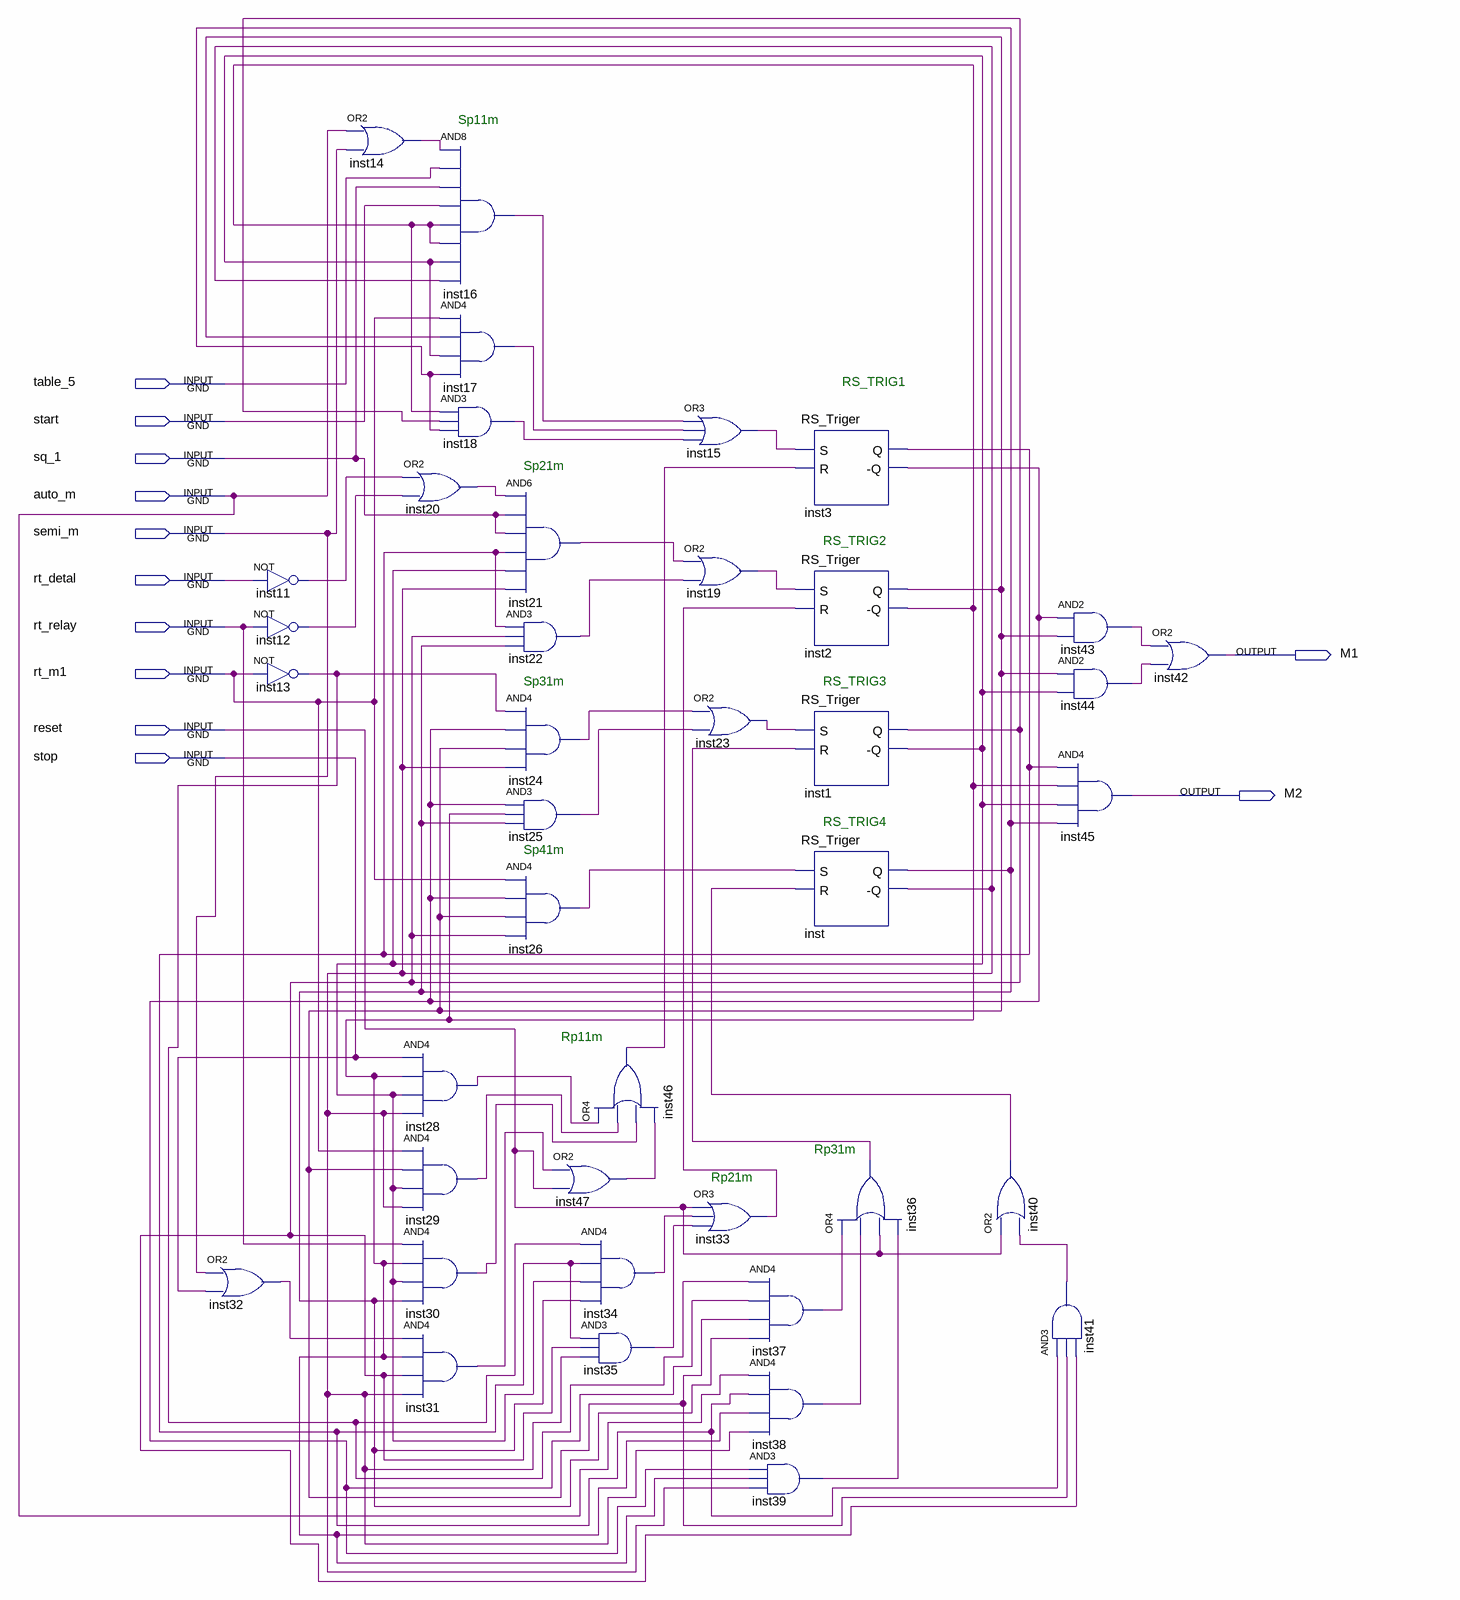
[diagram p0: schematic sheet]
// Quartus schematic auto_table_5.bdf as structural Verilog: 40 symbols, 12 pins
module auto_table_5 (
  input  table_5,
  input  start,
  input  sq_1,
  input  auto_m,
  input  semi_m,
  input  rt_detal,
  input  rt_relay,
  input  rt_m1,
  input  reset,
  input  stop,
  output M1,
  output M2
);

  wire inst1__q, inst1_q, inst2__q, inst2_q, inst3__q, inst3_q, inst11_out, inst12_out, inst13_out,
       inst14_out, inst15_out, inst16_out, inst17_out, inst18_out, inst19_out, inst20_out, inst21_out,
       inst22_out, inst23_out, inst24_out, inst25_out, inst26_out, inst28_out, inst29_out, inst30_out,
       inst31_out, inst32_out, inst33_out, inst34_out, inst35_out, inst36_out, inst37_out, inst38_out,
       inst39_out, inst40_out, inst41_out, inst43_out, inst44_out, inst46_out, inst47_out, inst__q, inst_q;

  or inst32 (inst32_out, semi_m, stop);
  not inst11 (inst11_out, rt_detal);
  not inst12 (inst12_out, rt_relay);
  not inst13 (inst13_out, rt_m1);
  or inst14 (inst14_out, auto_m, semi_m);
  and inst16 (inst16_out, inst14_out, table_5, sq_1, start, inst2__q, inst2__q, inst1__q, inst__q);
  and inst17 (inst17_out, rt_m1, inst2_q, inst1__q, inst_q);
  and inst18 (inst18_out, inst2__q, inst1_q, inst_q);
  or inst20 (inst20_out, inst11_out, inst12_out);
  and inst28 (inst28_out, stop, inst2__q, inst1__q, inst__q);
  and inst29 (inst29_out, rt_m1, inst2_q, inst1__q, inst__q);
  and inst30 (inst30_out, rt_relay, inst2__q, inst1__q, inst_q);
  and inst31 (inst31_out, inst32_out, inst2__q, inst1_q, inst__q);
  and inst21 (inst21_out, inst20_out, sq_1, sq_1, inst3_q, inst1__q, inst__q);
  and inst22 (inst22_out, inst3_q, inst1_q, inst_q);
  and inst24 (inst24_out, inst13_out, inst3__q, inst2_q, inst__q);
  and inst25 (inst25_out, inst3__q, inst2__q, inst_q);
  and inst26 (inst26_out, rt_m1, inst3__q, inst2_q, inst1_q);
  or inst46 (inst46_out, inst28_out, inst29_out, inst30_out, inst47_out);
  or inst47 (inst47_out, inst31_out, reset);
  and inst34 (inst34_out, inst13_out, inst3_q, inst1__q, inst_q);
  and inst35 (inst35_out, inst3_q, inst1_q, inst__q);
  or inst15 (inst15_out, inst16_out, inst17_out, inst18_out);
  or inst19 (inst19_out, inst21_out, inst22_out);
  or inst23 (inst23_out, inst24_out, inst25_out);
  or inst33 (inst33_out, reset, inst34_out, inst35_out);
  and inst37 (inst37_out, inst13_out, inst3__q, inst2_q, inst_q);
  and inst38 (inst38_out, auto_m, inst3_q, inst2__q, inst__q);
  and inst39 (inst39_out, inst3__q, inst2__q, inst__q);
  RS_Triger inst3 (.S(inst15_out), .R(inst46_out), .Q(inst3_q), .\-Q (inst3__q));
  RS_Triger inst2 (.S(inst19_out), .R(inst33_out), .Q(inst2_q), .\-Q (inst2__q));
  RS_Triger inst1 (.S(inst23_out), .R(inst36_out), .Q(inst1_q), .\-Q (inst1__q));
  RS_Triger inst (.S(inst26_out), .R(inst40_out), .Q(inst_q), .\-Q (inst__q));
  or inst36 (inst36_out, inst37_out, inst38_out, reset, inst39_out);
  or inst40 (inst40_out, reset, inst41_out);
  and inst43 (inst43_out, inst3__q, inst2_q);
  and inst44 (inst44_out, inst2_q, inst1__q);
  and inst45 (M2, inst3_q, inst2__q, inst1__q, inst_q);
  and inst41 (inst41_out, inst3_q, inst2_q, inst1_q);
  or inst42 (M1, inst43_out, inst44_out);

  // Notes on the sheet:
  //   Sp11m
  //   RS_TRIG1
  //   Sp21m
  //   RS_TRIG2
  //   Sp31m
  //   RS_TRIG3
  //   RS_TRIG4
  //   Sp41m
  //   Rp11m
  //   Rp31m
  //   Rp21m
endmodule
